# EAGLE design Schematic (EAGLE 6.6.0)
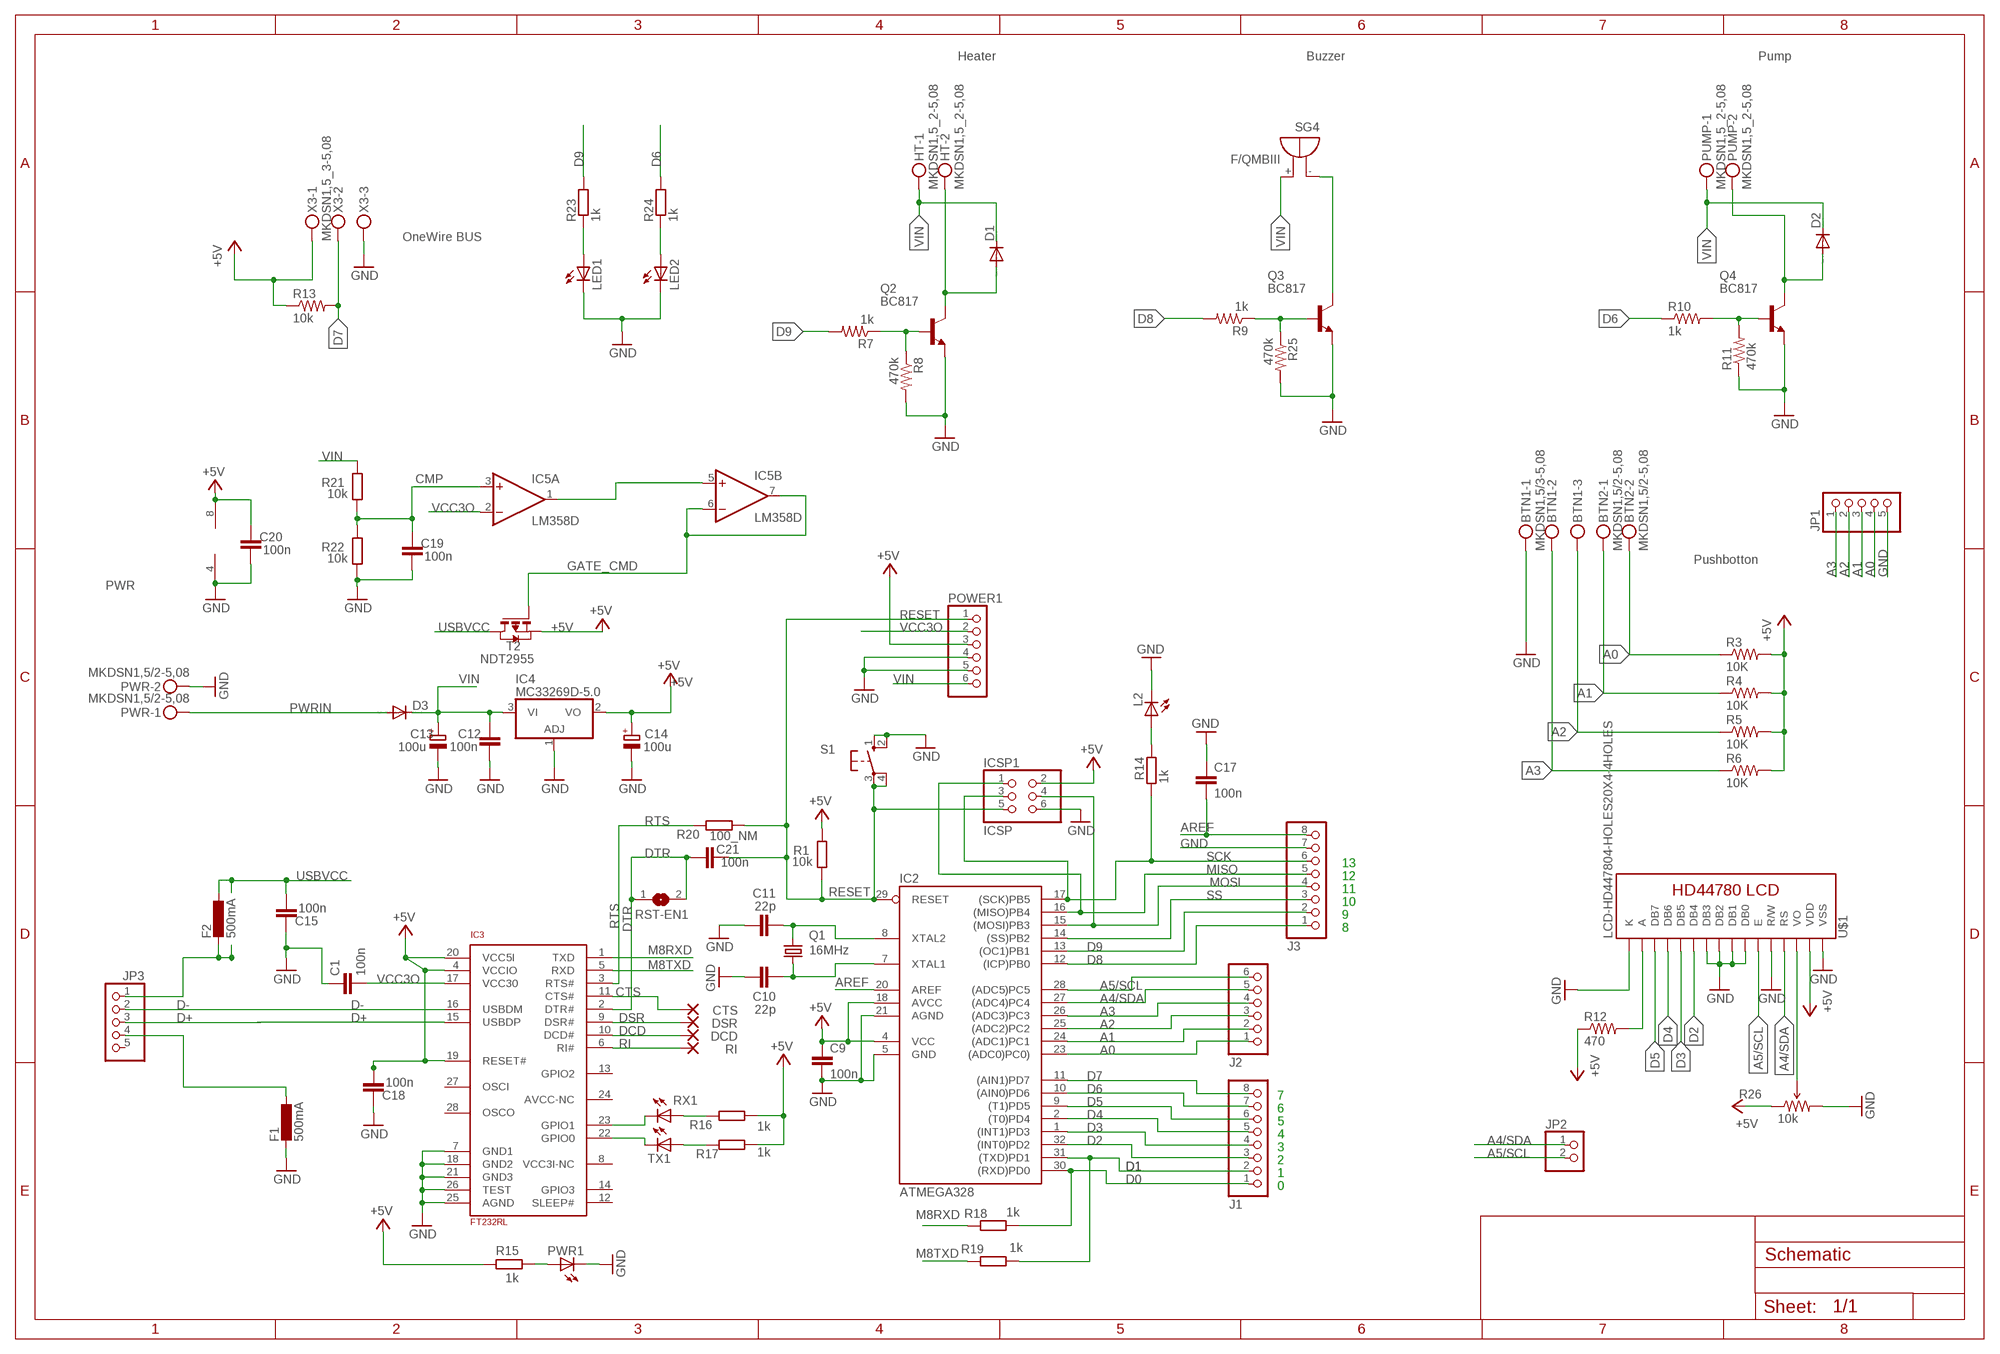
[diagram p0: schematic, sheet 1]

## Parts
BTN1  MKDSN1,5/3-5,08  [MKDSN1,5/3-5,08]
BTN2  MKDSN1,5/2-5,08  [MKDSN1,5/2-5,08]
C1  100n  C-EUC0603  [C0603]
C9  100n  C-EUC0603  [C0603]
C10  22p  C-EUC0603  [C0603]
C11  22p  C-EUC0603  [C0603]
C12  100n  C-EUC0603  [C0603]
C13  100u  CPOL-EUD  [PANASONIC_D]
C14  100u  CPOL-EUD  [PANASONIC_D]
C15  100n  C-EUC0603  [C0603]
C17  100n  C-EUC0603  [C0603]
C18  100n  C-EUC0603  [C0603]
C19  100n  C-EUC0603  [C0603]
C20  100n  C-EUC0603  [C0603]
C21  100n  C-EUC0603  [C0603]
CTS  SMD2  [SMD1,27-2,54]
D1  DIODE-SMB  [SMB]
D2  DIODE-SMB  [SMB]
D3  DIODE-SMB  [SMB]
DCD  SMD2  [SMD1,27-2,54]
DSR  SMD2  [SMD1,27-2,54]
F1  500mA  L-EUL1812  [L1812]
F2  500mA  L-EUL1812  [L1812]
HT  MKDSN1,5_2-5,08  [MKDSN1,5-2-5,08]
IC2  ATMEGA328  AT90S4433A  [TQFP32-08]
IC3  FT232RL  [SSOP28]
IC4  MC33269D-5.0  [DPACK]
IC5  LM358D  [SO08]
ICSP1  ICSP  PINHD-2X3  [2X03]
J1  PINHD-1X8  [1X08]
J2  PINHD-1X6  [1X06]
J3  PINHD-1X8  [1X08]
JP1  PINHD-1X5/90  [1X05/90]
JP2  PINHD-1X2/90  [1X02/90]
JP3  PINHD-1X5/90  [1X05/90]
L2  LEDSML0805  [SML0805]
LED1  LED5MM  [LED5MM]
LED2  LED5MM  [LED5MM]
POWER1  PINHD-1X6  [1X06]
PUMP  MKDSN1,5_2-5,08  [MKDSN1,5-2-5,08]
PWR  MKDSN1,5/2-5,08  [MKDSN1,5/2-5,08]
PWR1  LEDSML0805  [SML0805]
Q1  16MHz  CRYTALHC49S  [HC49/S]
Q2  BC817  BC817-NPN-SOT23-BEC  [SOT23-BEC]
Q3  BC817  BC817-NPN-SOT23-BEC  [SOT23-BEC]
Q4  BC817  BC817-NPN-SOT23-BEC  [SOT23-BEC]
R1  10k  R-EU_R0603  [R0603]
R3  10K  R-US_R0603  [R0603]
R4  10K  R-US_R0603  [R0603]
R5  10K  R-US_R0603  [R0603]
R6  10K  R-US_R0603  [R0603]
R7  1k  R-US_R0603  [R0603]
R8  470k  R-US_R0603  [R0603]
R9  1k  R-US_R0603  [R0603]
R10  1k  R-US_R0603  [R0603]
R11  470k  R-US_R0603  [R0603]
R12  470  R-US_R1206  [R1206]
R13  10k  R-US_R0603  [R0603]
R14  1k  R-EU_R0603  [R0603]
R15  1k  R-EU_R0603  [R0603]
R16  1k  R-EU_R0603  [R0603]
R17  1k  R-EU_R0603  [R0603]
R18  1k  R-EU_R0603  [R0603]
R19  1k  R-EU_R0603  [R0603]
R20  100_NM  R-EU_R0603  [R0603]
R21  10k  R-EU_R0603  [R0603]
R22  10k  R-EU_R0603  [R0603]
R23  1k  R-EU_R0603  [R0603]
R24  1k  R-EU_R0603  [R0603]
R25  470k  R-US_R0603  [R0603]
R26  10k  TRIMPOTTRIMPOT-5MM  [TRIMPOT-5MM]
RI  SMD2  [SMD1,27-2,54]
RST-EN1  SJ  [SJ]
RX1  LEDSML0805  [SML0805]
S1  10-XX  [B3F-10XX]
SG4  F/QMBIII  [F/QMBIII]
T2  NDT2955  PMOSSOT223  [SOT223]
TX1  LEDSML0805  [SML0805]
U$1  LCD-HD447804-HOLES20X4-4HOLES  [LCD-20X4-4HOLES]
X3  MKDSN1,5_3-5,08  [MKDSN1,5-3-5,08]

## Nets
+5V [+5V]: C9.1 C14.+ C18.1 C20.2 IC2.4(VCC) IC2.18(AVCC) IC3.4(VCCIO) IC3.19(RESET#) IC3.20(VCC5I) IC4.2(VO) IC5.8(P:V+) ICSP1.2 POWER1.3 R1.2 R3.2 R4.2 R5.2 R6.2 R12.1 R13.1 R15.1 R16.2 R17.2 R26.A(CCW) T2.3(S) U$1.P$2(VDD) X3.1
A0: BTN2.2 IC2.23((ADC0)PC0)) J2.1 JP1.4 R3.1
A1: BTN2.1 IC2.24((ADC1)PC1) J2.2 JP1.3 R4.1
A2: BTN1.3 IC2.25((ADC2)PC2) J2.3 JP1.2 R5.1
A3: BTN1.2 IC2.26((ADC3)PC3) J2.4 JP1.1 R6.1
A4/SDA: IC2.27((ADC4)PC4) J2.5 JP2.1 U$1.P$4(RS)
A5/SCL: IC2.28((ADC5)PC5) J2.6 JP2.2 U$1.P$6(E)
AREF: C17.2 IC2.20(AREF) J3.8
CMP: C19.2 IC5.3(A:+IN) R21.1 R22.2
CTS: CTS.1(P) IC3.11(CTS#)
D0: IC2.30((RXD)PD0) J1.1 R18.1
D1: IC2.31((TXD)PD1) J1.2 R19.1
D2: IC2.32((INT0)PD2) J1.3 U$1.P$11(DB4)
D3: IC2.1((INT1)PD3) J1.4 U$1.P$12(DB5)
D4: IC2.2((T0)PD4) J1.5 U$1.P$13(DB6)
D5: IC2.9((T1)PD5) J1.6 U$1.P$14(DB7)
D6: IC2.10((AIN0)PD6) J1.7 R10.1 R24.2
D7: IC2.11((AIN1)PD7) J1.8 R13.2 X3.2
D8: IC2.12((ICP)PB0) J3.1 R9.2
D9: IC2.13((OC1)PB1) J3.2 R7.2 R23.2
D+: IC3.15(USBDP) JP3.3
D-: IC3.16(USBDM) JP3.2
DCD: DCD.1(P) IC3.10(DCD#)
DSR: DSR.1(P) IC3.9(DSR#)
DTR: C21.1 IC3.2(DTR#) RST-EN1.1 RST-EN1.2
GATE_CMD: IC5.6(B:-IN) IC5.7(B:OUT) T2.1(G)
GND: BTN1.1 C1.1 C9.2 C10.1 C11.1 C12.1 C13.- C14.- C15.2 C17.1 C18.2 C19.1 C20.1 F1.2 IC2.5(GND) IC2.21(AGND) IC3.7(GND1) IC3.18(GND2) IC3.21(GND3) IC3.25(AGND) IC3.26(TEST) IC4.1(ADJ) IC5.4(P:V-) ICSP1.6 J3.7 JP1.5 L2.C LED1.K(C) LED2.K(C) POWER1.4 POWER1.5 PWR1.C PWR.2 Q2.E Q3.E Q4.E R8.2 R11.1 R22.1 R25.2 R26.C(CW) S1.1(S) S1.2(S1) U$1.P$1(VSS) U$1.P$5(R/W) U$1.P$7(DB0) U$1.P$8(DB1) U$1.P$9(DB2) U$1.P$10(DB3) U$1.P$16(K) X3.3
M8RXD: IC3.1(TXD) R18.2
M8TXD: IC3.5(RXD) R19.2
MISO: IC2.16((MISO)PB4) ICSP1.1 J3.5
MOSI: IC2.15((MOSI)PB3) ICSP1.4 J3.4
N$3 [GND]: F1.1 JP3.4
N$4: D1.A HT.2 Q2.C
N$5: Q2.B R7.1 R8.1
N$6: D2.A PUMP.2 Q4.C
N$7: Q3.C SG4.-(+)
N$8: Q3.B R9.1 R25.1
N$9: Q4.B R10.2 R11.2
N$10: R12.2 U$1.P$15(A)
N$12: R26.B(WIPER) U$1.P$3(VO)
N$13: LED1.A R23.1
N$14: LED2.A R24.1
N$54: C10.2 IC2.7(XTAL1) Q1.1
N$55: C11.2 IC2.8(XTAL2) Q1.2
N$70: PWR1.A R15.2
N$71: IC3.23(GPIO1) RX1.C
N$72: IC3.22(GPIO0) TX1.C
N$73: R16.1 RX1.A
N$74: R17.1 TX1.A
N$75 [USBVCC]: F2.2 JP3.1
N$76: L2.A R14.1
N$77: IC5.1(A:OUT) IC5.5(B:+IN)
PWRIN [PWRIN]: D3.A PWR.1
RESET: C21.2 IC2.29(RESET) ICSP1.5 POWER1.1 R1.1 R20.2 S1.3(P) S1.4(P1)
RI: IC3.6(RI#) RI.1(P)
RTS: IC3.3(RTS#) R20.1
SCK: IC2.17((SCK)PB5) ICSP1.3 J3.6 R14.2
SS: IC2.14((SS)PB2) J3.3
USBVCC [USBVCC]: C15.1 F2.1 T2.2(D) T2.4(D)
VCC3O: C1.2 IC3.17(VCC30) IC5.2(A:-IN) POWER1.2
VIN [PWRIN]: C12.2 C13.+ D1.C D2.C D3.C HT.1 IC4.3(VI) POWER1.6 PUMP.1 R21.2 SG4.+(-)
Unconnected: IC3.8(VCC3I-NC) IC3.12(SLEEP#) IC3.13(GPIO2) IC3.14(GPIO3) IC3.24(AVCC-NC) IC3.27(OSCI) IC3.28(OSCO) JP3.5

## Notes on the sheet
- Heater | Buzzer | Pump
- OneWire BUS
- Pushbotton
- PWR
- 13
- 12
- 11
- 10
- 9
- 8
- 7
- 6
- 5
- 4
- 3
- 2
- 1
- 0

## Library data of the parts
BTN1 = con-phoenix-508:MKDSN1,5/3-5,08: MKDSN 1,5/ 3-5,08 Printklemme Nennstrom: 13,5 A Nennspannung: 250 V Rastermaß: 5,08 mm Polzahl: 3 Anschlussart: Schraubanschluss Montage: Löten Anschlussrichtung Leiter/Platine: 0 ° Artikelnummer: 1729131 Source: http://eshop.phoenixcontact.com .. 1729131.pdf; OC_NEWARK: unknown
BTN2 PWR = con-phoenix-508:MKDSN1,5/2-5,08: MKDSN 1,5/ 2-5,08 Printklemme Nennstrom: 13,5 A Nennspannung: 250 V Rastermaß: 5,08 mm Polzahl: 2 Anschlussart: Schraubanschluss Montage: Löten Anschlussrichtung Leiter/Platine: 0 ° Artikelnummer: 1729128 Source: http://eshop.phoenixcontact.com .. 1729128.pdf; OC_NEWARK: unknown
C1 C9-C12 C15 C17-C21 = rcl:C-EU: CAPACITOR, European symbol
C13 C14 = rcl:CPOL-EU: POLARIZED CAPACITOR, European symbol
CTS DCD DSR RI = wirepad:SMD2: SMD PAD
D1-D3 = diode:DIODE-: DIODE
F1 F2 = rcl:L-EU: INDUCTOR, European symbol
HT PUMP = con-phoenix-508:MKDSN1,5_2-5,08: MKDSN 1,5/ 2-5,08 Printklemme Nennstrom: 13,5 A Nennspannung: 250 V Rastermaß: 5,08 mm Polzahl: 2 Anschlussart: Schraubanschluss Montage: Löten Anschlussrichtung Leiter/Platine: 0 ° Artikelnummer: 1729128 Source: http://eshop.phoenixcontact.com .. 1729128.pdf; OC_NEWARK: unknown
IC2 = atmel:AT90S4433: MICROCONTROLLER 4 Kbytes FLASH 128 bytes SRAM 256 bytes EEPROM UART 6-channel 10 bit ADC; OC_FARNELL: unknown; OC_NEWARK: unknown
IC3 = SmartPrj:FT232RL
IC4 = linear:MC33269?*: Adjustable Output Low Dropout Voltage Regulator 800 mA Source: http://www.onsemi.com/pub/Collateral/MC33269-D.PDF
IC5 = linear:LM358: OP AMP also LM158; LM258; LM2904 Source: http://cache.national.com/ds/LM/LM158.pdf
ICSP1 = pinhead:PINHD-2X3: PIN HEADER
J1 J3 = pinhead:PINHD-1X8: PIN HEADER
J2 POWER1 = pinhead:PINHD-1X6: PIN HEADER
JP1 JP3 = pinhead:PINHD-1X5: PIN HEADER
JP2 = pinhead:PINHD-1X2: PIN HEADER
L2 LED1 LED2 PWR1 RX1 TX1 = led:LED: LED OSRAM: - CHIPLED LG R971, LG N971, LY N971, LG Q971, LY Q971, LO R971, LY R971 LH N974, LH R974 LS Q976, LO Q976, LY Q976 LO Q996 - Hyper CHIPLED LW Q18S LB Q993, LB Q99A, LB R99A - SideLED LS A670, LO A670, LY A670, LG A670, LP A670 LB A673, LV A673, LT A673, LW A673 LH A674 LY A675 LS A676, LA A676, LO A676, LY A676, LW A676 LS A679, LY A679, LG A679 - Hyper Micro SIDELED® LS Y876, LA Y876, LO Y876, LY Y876 LT Y87S - SmartLED LW L88C, LW L88S LB L89C, LB L89S, LG L890 LS L89K, LO L89K, LY L89K LS L896, LA L896, LO L896, LY L896 - TOPLED LS T670, LO T670, LY T670, LG T670, LP T670 LSG T670, LSP T670, LSY T670, LOP T670, LYG T670 LG T671, LOG T671, LSG T671 LB T673, LV T673, LT T673, LW T673 LH T674 LS T676, LA T676, LO T676, LY T676, LB T676, LH T676, LSB T676, LW T676 LB T67C, LV T67C, LT T67C, LS T67K, LO T67K, LY T67K, LW E67C LS E67B, LA E67B, LO E67B, LY E67B, LB E67C, LV E67C, LT E67C LW T67C LS T679, LY T679, LG T679 LS T770, LO T770, LY T770, LG T770, LP T770 LB T773, LV T773, LT T773, LW T773 LH T774 LS E675, LA E675, LY E675, LS T675 LS T776, LA T776, LO T776, LY T776, LB T776 LHGB T686 LT T68C, LB T68C - Hyper Mini TOPLED® LB M676 - Mini TOPLED Santana® LG M470 LS M47K, LO M47K, LY M47K Source: http://www.osram.convergy.de LUXEON: - LUMILED® LXK2-PW12-R00, LXK2-PW12-S00, LXK2-PW14-U00, LXK2-PW14-V00 LXK2-PM12-R00, LXK2-PM12-S00, LXK2-PM14-U00 LXK2-PE12-Q00, LXK2-PE12-R00, LXK2-PE12-S00, LXK2-PE14-T00, LXK2-PE14-U00 LXK2-PB12-K00, LXK2-PB12-L00, LXK2-PB12-M00, LXK2-PB14-N00, LXK2-PB14-P00, LXK2-PB14-Q00 LXK2-PR12-L00, LXK2-PR12-M00, LXK2-PR14-Q00, LXK2-PR14-R00 LXK2-PD12-Q00, LXK2-PD12-R00, LXK2-PD12-S00 LXK2-PH12-R00, LXK2-PH12-S00 LXK2-PL12-P00, LXK2-PL12-Q00, LXK2-PL12-R00 Source: www.luxeon.com KINGBRIGHT: KA-3528ASYC Source: www.kingbright.com
Q1 = crystal:CRYTAL: CRYSTAL
Q2-Q4 = transistor:*-NPN-: NPN Transistror BF959 corrected 2008.03.06
R1 R14-R24 = rcl:R-EU_: RESISTOR, European symbol
R3-R13 R25 = resistor:R-US_: RESISTOR, American symbol; OC_NEWARK: unknown
R26 = SparkFun-Electromechanical:TRIMPOT: Various small potentiometers for "set-and-forget" applications
RST-EN1 = jumper:SJ: SMD solder JUMPER
S1 = switch-omron:10-XX: OMRON SWITCH; MPN: B3F-1000; OC_FARNELL: 176432; OC_NEWARK: 36M3542
SG4 = buzzer:F/QMBIII: BUZZER Source: Buerklin; OC_FARNELL: unknown; OC_NEWARK: unknown
T2 = zetex:PMOSSOT223: MOS FET; OC_FARNELL: unknown; OC_NEWARK: unknown
U$1 = HD44780LCD:LCD-HD44780
X3 = con-phoenix-508:MKDSN1,5_3-5,08: MKDSN 1,5/ 3-5,08 Printklemme Nennstrom: 13,5 A Nennspannung: 250 V Rastermaß: 5,08 mm Polzahl: 3 Anschlussart: Schraubanschluss Montage: Löten Anschlussrichtung Leiter/Platine: 0 ° Artikelnummer: 1729131 Source: http://eshop.phoenixcontact.com .. 1729131.pdf; OC_NEWARK: unknown

## Net classes
0 default: width 0.254 mm, clearance 0.254 mm
1 PWRIN: width 0.61 mm, drill 0.508 mm, clearance 0.205 mm to class 0, clearance 0.254 mm
2 GND: width 0.305 mm, drill 0.508 mm, clearance 0.205 mm to class 0, clearance 0.205 mm to class 1, clearance 0.254 mm
3 USBVCC: width 0.508 mm, drill 0.508 mm, clearance 0.205 mm to class 0, clearance 0.205 mm to class 1, clearance 0.205 mm to class 2, clearance 0.254 mm
4 +5V: width 0.406 mm, drill 0.508 mm, clearance 0.205 mm to class 0, clearance 0.205 mm to class 1, clearance 0.205 mm to class 2, clearance 0.205 mm to class 3, clearance 0.254 mm

## Board
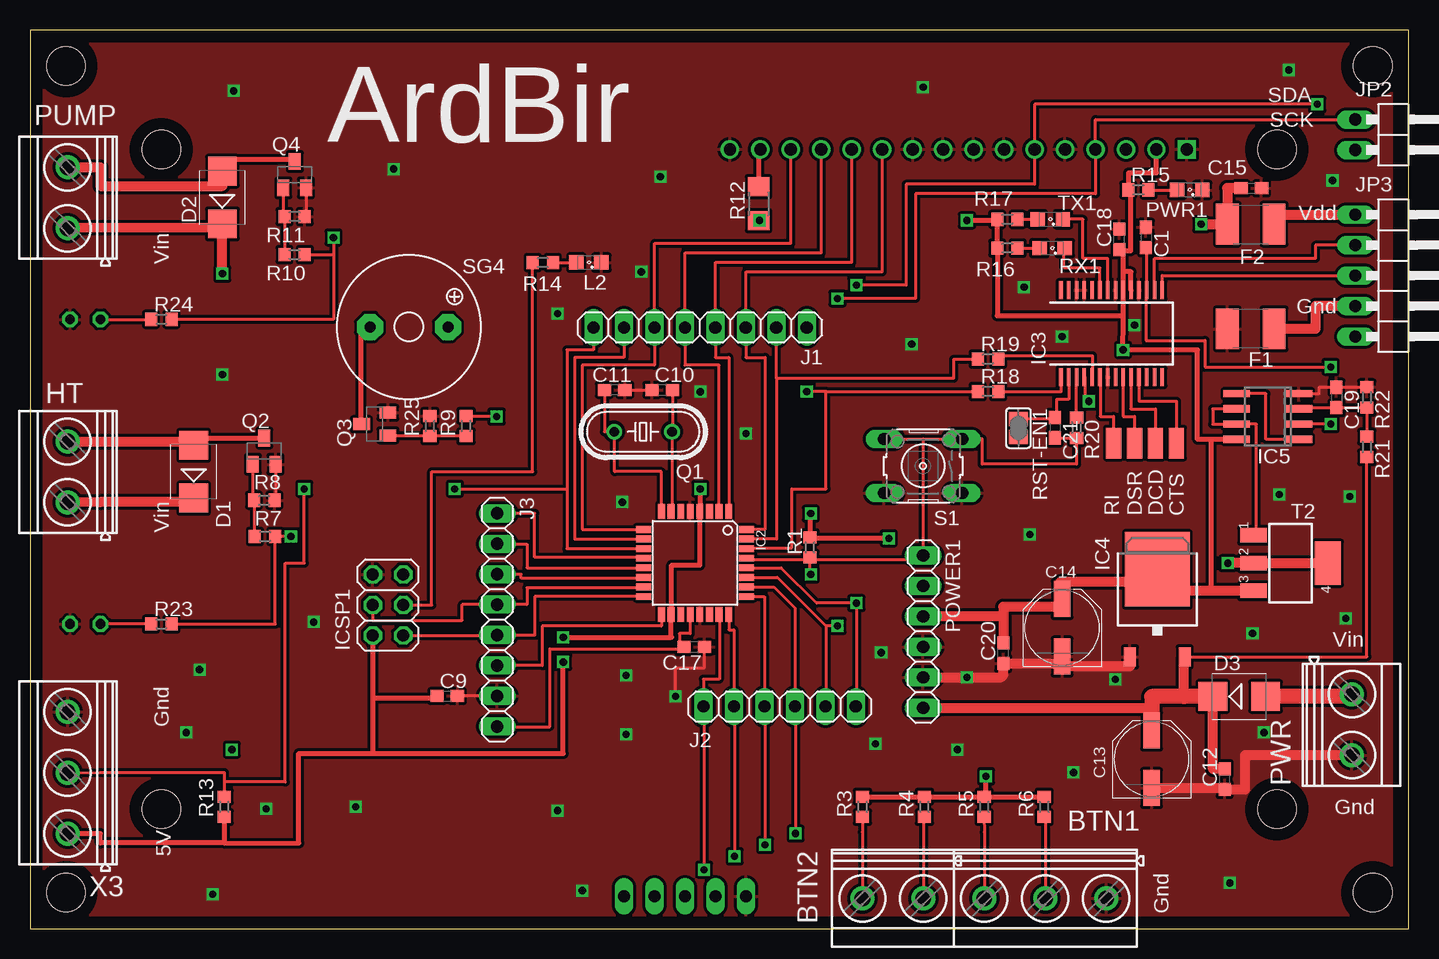
[diagram p1: board, top side]
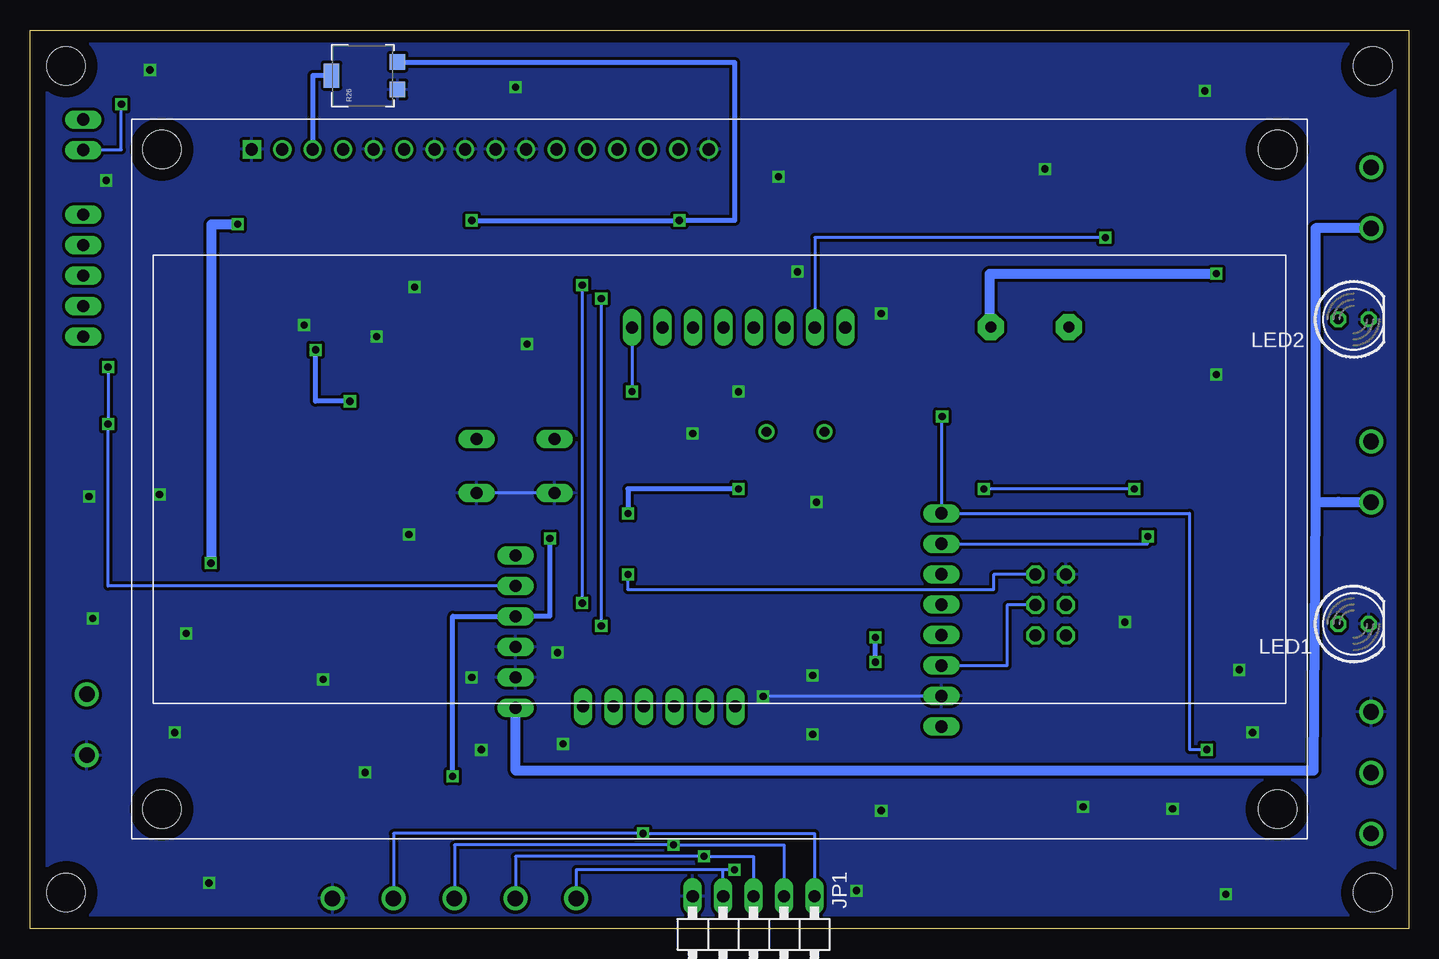
[diagram p2: board, bottom side, seen from below]

Size 114.93 x 74.93 mm. Coordinates in mm from the lower left corner, seen from the top.
Outline: 114.93,74.93 0,74.93 0,0 114.93,0 114.93,74.93
Copper layers (1*16): Top 0.035mm / dielectric 1.5mm / Bottom 0.035mm
Design rules "default *": minimum track width 10mil, minimum drill 20mil, track to track 8mil, track to pad 8mil, pad to pad 8mil, via to via 8mil, smd to smd 8mil, copper to edge 40mil, drill to drill 8mil, minimum pad ring 10mil, minimum via ring 8mil, stop-mask expansion 4mil, vias tented up to drill 0mil, thermal gap 10mil
Holes 3.2 mm at 3,3 3,71.93 111.93,3 111.93,71.93

### Footprints (pad centres in the part's own frame; a part is rotated, then mirrored left to right if it is on the bottom)
MKDSN1,5/3-5,08 = drill 1.3 pad 2: 1 -7.641,0.025; 2 -2.561,0.025; 3 2.519,0.025
MKDSN1,5/2-5,08 = drill 1.3 pad 2: 1 -2.561,0.025; 2 2.519,0.025
C0603 = smd 1.1 x 1: 1 -0.85,0; 2 0.85,0
PANASONIC_D = smd 3 x 1.4: + 2.4,0; - -2.4,0
SMD1,27-2,54 = smd 1.27 x 2.54: 1 0,0
SMB = smd 2.4 x 2.4: A 2.2,0; C -2.2,0
L1812 = smd 1.9 x 3.4: 1 -1.95,0; 2 1.95,0
MKDSN1,5-2-5,08 = drill 1.3 pad 2: 1 -2.561,0.025; 2 2.519,0.025
TQFP32-08 = smd 1.27 x 0.559: 1 -4.293,2.8; 2 -4.293,2; 3 -4.293,1.2; 4 -4.293,0.4; 5 -4.293,-0.4; 6 -4.293,-1.2; 7 -4.293,-2; 8 -4.293,-2.8; 17 4.293,-2.8; 18 4.293,-2; 19 4.293,-1.2; 20 4.293,-0.4; 21 4.293,0.4; 22 4.293,1.2; 23 4.293,2; 24 4.293,2.8 | smd 0.559 x 1.27: 9 -2.8,-4.293; 10 -2,-4.293; 11 -1.2,-4.293; 12 -0.4,-4.293; 13 0.4,-4.293; 14 1.2,-4.293; 15 2,-4.293; 16 2.8,-4.293; 25 2.8,4.293; 26 2,4.293; 27 1.2,4.293; 28 0.4,4.293; 29 -0.4,4.293; 30 -1.2,4.293; 31 -2,4.293; 32 -2.8,4.293
SSOP28 = smd 0.381 x 1.499: 1 -4.225,-3.625; 2 -3.575,-3.625; 3 -2.925,-3.625; 4 -2.275,-3.625; 5 -1.625,-3.625; 6 -0.975,-3.625; 7 -0.325,-3.625; 8 0.325,-3.625; 9 0.975,-3.625; 10 1.625,-3.625; 11 2.275,-3.625; 12 2.925,-3.625; 13 3.575,-3.625; 14 4.225,-3.625; 15 4.225,3.625; 16 3.575,3.625; 17 2.925,3.625; 18 2.275,3.625; 19 1.625,3.625; 20 0.975,3.625; 21 0.325,3.625; 22 -0.325,3.625; 23 -0.975,3.625; 24 -1.625,3.625; 25 -2.275,3.625; 26 -2.925,3.625; 27 -3.575,3.625; 28 -4.225,3.625
DPACK = smd 1 x 1.6: 1 -2.28,-4.8; 3 2.28,-4.8 | smd 5.4 x 6.2: 2 0,2.5
SO08 = smd 0.6 x 2.2: 1 -1.905,-2.6; 2 -0.635,-2.6; 3 0.635,-2.6; 4 1.905,-2.6; 5 1.905,2.6; 6 0.635,2.6; 7 -0.635,2.6; 8 -1.905,2.6
2X03 = drill 1.016 octagon: 1 -2.54,-1.27; 2 -2.54,1.27; 3 0,-1.27; 4 0,1.27; 5 2.54,-1.27; 6 2.54,1.27
1X08 = drill 1.016 long: 1 -8.89,0; 2 -6.35,0; 3 -3.81,0; 4 -1.27,0; 5 1.27,0; 6 3.81,0; 7 6.35,0; 8 8.89,0
1X06 = drill 1.016 long: 1 -6.35,0; 2 -3.81,0; 3 -1.27,0; 4 1.27,0; 5 3.81,0; 6 6.35,0
1X05/90 = drill 1.016 long: 1 -5.08,-3.81; 2 -2.54,-3.81; 3 0,-3.81; 4 2.54,-3.81; 5 5.08,-3.81
1X02/90 = drill 1.016 long: 1 -1.27,-3.81; 2 1.27,-3.81
SML0805 = smd 1.2 x 1.2: A 1.05,0; C -1.05,0
LED5MM = drill 0.813 octagon: A -1.27,0; K 1.27,0
HC49/S = drill 0.813: 1 -2.413,0; 2 2.413,0
SOT23-BEC = smd 1 x 1.4: B -0.95,-1.1; C 0,1.1; E 0.95,-1.1
R0603 = smd 1 x 1.1: 1 -0.85,0; 2 0.85,0
R1206 = smd 1.6 x 1.803: 1 -1.422,0; 2 1.422,0
TRIMPOT-5MM = smd 1.3 x 1.3: A 1.15,-2.54; C -1.15,-2.54 | smd 2 x 1.3: B 0,2.96
SJ = smd 1.168 x 1.6: 1 -0.762,0; 2 0.762,0
B3F-10XX = drill 1.016 long: 1 -3.251,2.261; 2 3.251,2.261; 3 -3.251,-2.261; 4 3.251,-2.261
F/QMBIII = drill 0.914 pad 2.159 octagon: + 3.251,0; - -3.251,0
SOT223 = smd 1.219 x 2.235: 1 -2.311,-3.099; 2 0,-3.099; 3 2.311,-3.099 | smd 3.6 x 2.2: 4 0,3.099
LCD-20X4-4HOLES = drill 1.016 square: P$1 10,57.5 | drill 1.016: P$2 12.54,57.5; P$3 15.08,57.5; P$4 17.62,57.5; P$5 20.16,57.5; P$6 22.7,57.5; P$7 25.24,57.5; P$8 27.78,57.5; P$9 30.32,57.5; P$10 32.86,57.5; P$11 35.4,57.5; P$12 37.94,57.5; P$13 40.48,57.5; P$14 43.02,57.5; P$15 45.56,57.5; P$16 48.1,57.5 | hole 3.2: 2.5,2.5; 2.5,57.5; 95.5,57.5; 95.5,2.5
MKDSN1,5-3-5,08 = drill 1.3 pad 2: 1 -7.641,0.025; 2 -2.561,0.025; 3 2.519,0.025

### Placement (x,y rotation side)
BTN1  82.07,2.54 180 top
BTN2  71.91,2.54 180 top
C1  93.03,57.63 270 top
C9  34.78,19.39 0 top
C10  52.7,44.93 0 top
C11  48.74,44.93 180 top
C12  99.6,12.47 90 top
C13  93.5,14.13 90 top
C14  86.04,25.08 90 top
C15  101.81,61.73 0 top
C17  55.37,23.47 180 top
C18  90.81,57.47 90 top
C19  108.9,44.29 270 top
C20  81.13,22.96 90 top
C21  85.43,41.77 270 top
CTS  95.57,40.48 0 top
D1  13.65,38.1 90 top
D2  16.03,60.96 90 top
D3  100.81,19.37 0 top
DCD  93.82,40.48 0 top
DSR  92.08,40.48 0 top
F1  101.76,50.01 180 top
F2  101.76,58.74 0 top
HT  3.16,38.1 90 top
IC2  55.44,30.49 270 top
IC3  90.16,49.62 0 top
IC4  93.98,27.46 0 top
IC5  103.19,42.7 90 top
ICSP1  29.84,26.99 90 top
J1  55.86,50.13 180 top
J2  62.49,18.52 0 top
J3  38.95,25.74 270 top
JP1  54.61,-1.11 180 bottom
JP2  114.3,66.2 270 top
JP3  114.3,54.45 270 top
L2  46.59,55.54 180 top
LED1  4.6,25.4 0 bottom
LED2  4.6,50.8 0 bottom
POWER1  74.45,24.77 270 top
PUMP  3.16,60.96 90 top
PWR  110.17,16.99 270 top
PWR1  96.68,61.59 180 top
Q1  51.12,41.43 180 top
Q2  19.53,39.81 0 top
Q3  28.73,42.07 90 top
Q4  22.07,62.87 0 top
R1  65.02,31.79 90 top
R3  69.4,10.16 90 top
R4  74.56,10.16 90 top
R5  79.54,10.16 90 top
R6  84.54,10.16 90 top
R7  19.59,32.7 0 top
R8  19.53,35.72 0 top
R9  36.35,41.91 90 top
R10  22.07,56.2 180 top
R11  22.07,59.37 180 top
R12  60.74,60.45 90 top
R13  16.19,10.16 90 top
R14  42.75,55.54 180 top
R15  92.39,61.59 0 top
R16  81.48,56.75 180 top
R17  81.48,59.14 180 top
R18  79.86,44.79 0 top
R19  79.86,47.49 0 top
R20  87.24,41.77 270 top
R21  111.44,40.16 270 top
R22  111.44,44.29 270 top
R23  10.95,25.4 0 top
R24  10.95,50.8 0 top
R25  33.34,41.91 90 top
R26  86.84,71.12 90 bottom
RI  90.33,40.48 0 top
RST-EN1  82.4,41.74 270 top
RX1  85.21,56.75 180 top
S1  74.45,38.58 180 top
SG4  31.59,50.16 0 top
T2  105.09,30.48 270 top
TX1  85.05,59.14 180 top
U$1  106.44,7.47 0 bottom
X3  3.16,15.56 90 top

### Tracks (layer width: path | path; a pad name or v marks a point on that pad's centre or on a via)
+5V  (via drill 0.6)
  Top 0.254: IC3.4 87.95,45.99 87.95,43.97 v88.27,43.97
  Top 0.406: R3.2 R4.2 R5.2 79.69,11.01 | 16.19,7.14 22.41,7.14 22.41,14.61 28.57,14.61 | 91.14,54.77 IC3.20 91.14,51.12 | 91.14,54.77 91.14,56.52 | 91.14,56.52 91.76,56.52 91.76,61.59 91.6,61.59 | 28.57,14.61 44.45,14.61 v44.45,22.23 | v44.45,24.29 53.44,24.29 | ICSP1.2 28.57,19.21 | 28.57,19.21 28.57,14.61 | 79.69,11.01 v79.69,12.7 | IC5.8 98.42,40.8 | 98.42,40.8 98.42,28.17 | 91.14,54.77 91.79,54.77 IC3.19 | 91.14,51.12 91.14,50.64 v91.12,48.26 97.31,48.26 97.31,40.8 98.42,40.8 | v71.6,32.54 65.02,32.54 R1.2 65.02,34.61 v65.09,34.61 | 80.63,59.4 R17.2 | R17.2 R16.2 80.63,51.12 91.14,51.12 | 91.5,61.59 R15.1 91.6,61.59 | R17.2 80.63,59.37 | R13.1 16.19,7.93 16.19,7.14 | 16.19,7.14 5.87,7.14 5.87,7.92 X3.1 | C18.1 90.81,56.52 91.14,56.52 | 81.13,26.83 81.13,26.19 81.12,26.19 | 79.69,11.01 R6.2 | C9.1 33.93,19.21 28.57,19.21 | R17.2 80.63,59.05 v78.11,59.05 | v60.8,59.05 60.64,59.03 R12.1 | 53.5,24.29 53.44,24.29 | 53.44,24.29 IC2.18 53.5,26.2 53.5,30.32 55.84,30.32 IC2.4 55.88,34.78 v55.88,36.67 | 91.6,61.59 91.6,63.02 93.9,63.02 U$1.P$2
  Top 0.813: T2.3 98.42,28.17 94.77,28.17 94.77,28.89 93.98,28.89 | 93.98,28.89 85.88,28.89 85.88,26.83 | 85.88,26.83 86.04,26.83 C14.+ | 85.88,26.83 81.13,26.83 C20.2 | IC4.2 93.98,28.89 | 81.12,26.19 81.12,26.04 POWER1.3
  Bottom 0.406: v44.45,22.23 v44.45,24.29 | v79.69,12.7 79.69,26.04 POWER1.3 71.6,26.04 v71.6,32.54 | v88.27,43.97 91.12,43.97 v91.12,48.26 | v78.11,59.05 v60.8,59.05 56.2,59.05 56.2,72.23 84.3,72.23 R26.A | v55.88,36.67 65.09,36.67 v65.09,34.61
A0  (via drill 0.6)
  Top 0.254: R3.1 69.39,8.04 BTN2.2 | v56.2,18.52 v56.2,4.92 | IC2.23 57.47,26.2 57.47,20.8 56.14,20.8 J2.1
  Bottom 0.254: J2.1 v56.2,18.52 | v56.2,4.92 57.15,4.92 | 57.15,4.92 69.39,4.92 BTN2.2 | JP1.4 57.15,4.92
A1  (via drill 0.6)
  Top 0.254: v58.74,18.52 v58.74,6.03 | IC2.24 58.26,26.2 58.26,24.92 58.68,24.92 J2.2 | R4.1 74.47,9.31 BTN2.1
  Bottom 0.254: J2.2 v58.74,18.52 | BTN2.1 74.47,6.03 v58.74,6.03 54.61,6.03 JP1.3
A2  (via drill 0.6)
  Top 0.254: R5.1 79.56,8.04 BTN1.3 | v61.28,18.52 v61.28,6.99 | IC2.25 61.22,27.69 J2.3
  Bottom 0.254: J2.3 v61.28,18.52 | BTN1.3 79.56,6.99 v61.28,6.99 52.07,6.99 JP1.2
A3  (via drill 0.6)
  Top 0.254: v63.82,18.52 v63.82,7.94 | IC2.26 62.01,28.49 63.76,26.74 J2.4 | R6.1 84.64,9.31 BTN1.2
  Bottom 0.254: J2.4 v63.82,18.52 | BTN1.2 84.64,7.94 v63.82,7.94 49.53,7.94 JP1.1
A4/SDA  (via drill 0.6)
  Top 0.254: IC2.27 62.31,29.29 66.36,25.24 | 66.36,25.24 66.36,18.58 J2.5 | v67.31,52.55 73.82,52.55 73.82,61.28 88.82,61.28 U$1.P$4 88.82,67.47 JP2.1 | v67.31,25.24 66.36,25.24
  Bottom 0.254: v67.31,52.55 v67.31,25.24
A5/SCL  (via drill 0.6)
  Top 0.254: IC2.28 62.62,30.09 65.56,27.15 v68.9,27.15 68.9,18.58 J2.6 | v68.9,53.66 73.03,53.66 73.03,62.07 83.74,62.07 U$1.P$6 83.74,68.74 v107.31,68.74
  Bottom 0.254: v68.9,53.66 v68.9,27.15 | JP2.2 107.31,64.93 v107.31,68.74
AREF
  Top 0.254: IC2.20 55.04,24.61 54.13,24.61 54.13,23.47 C17.2 54.52,23.34 43.34,23.34 43.34,16.83 38.95,16.83 J3.8
CMP
  Top 0.254: IC5.3 105.79,43.44 C19.2 R22.2 R21.1
CTS
  Top 0.254: IC3.11 92.44,43.97 95.57,43.97 CTS.1
D0  (via drill 0.6)
  Top 0.254: IC2.30 59.73,31.75 63.5,31.75 63.5,36.67 66.36,36.67 66.36,44.79 | 66.36,44.79 R18.1 | 66.36,44.79 v64.75,44.79
  Bottom 0.254: J1.1 v64.75,44.79
D1
  Top 0.254: R19.1 79.02,47.47 76.99,47.47 76.99,45.88 62.23,45.88 | 62.23,45.88 62.23,32.49 IC2.31 | 62.23,45.88 62.23,50.13 J1.2
D2
  Top 0.254: IC2.32 61.28,33.29 61.28,47.62 59.67,47.62 J1.3 59.69,50.13 59.69,54.77 71.04,54.77 U$1.P$11
D3
  Top 0.254: IC2.1 58.26,34.78 58.26,47.62 57.13,47.62 J1.4 57.15,50.13 57.15,55.56 68.5,55.56 U$1.P$12
D4
  Top 0.254: IC2.2 57.44,46.99 54.59,46.99 J1.5 54.61,50.13 54.61,56.36 65.96,56.36 U$1.P$13
D5
  Top 0.254: IC2.9 46.04,33.29 46.04,46.99 52.05,46.99 J1.6 52.07,50.13 52.07,57.15 63.42,57.15 U$1.P$14
D6  (via drill 0.6)
  Top 0.254: J1.7 49.51,47.62 45.4,47.62 45.4,32.49 IC2.10 | v25.3,57.63 25.3,56.2 | 25.3,56.2 25.3,50.8 R24.2 | R10.1 25.3,56.2
  Bottom 0.254: v25.3,57.63 49.51,57.63 J1.7
D7  (via drill 0.6)
  Top 0.254: J1.8 46.97,48.26 44.77,48.26 44.77,36.67 | 44.77,36.67 44.77,31.69 IC2.11 | v22.86,36.67 22.86,30.48 21.27,30.48 21.27,12.22 16.19,12.22 | v35.4,36.67 44.77,36.67 | X3.2 5.85,13.02 16.19,13.02 16.19,12.22 | 16.19,12.22 R13.2
  Bottom 0.254: v22.86,36.67 v35.4,36.67
D8  (via drill 0.6)
  Top 0.254: IC2.12 51.15,30.96 42.07,30.96 42.07,34.63 J3.1 | v38.89,42.7 36.51,42.7 R9.2
  Bottom 0.254: v16.83,14.92 18.26,14.92 18.26,34.63 J3.1 38.89,34.63 v38.89,42.7
D9  (via drill 0.6)
  Top 0.254: J3.2 38.95,32.07 41.43,32.07 41.43,30.09 IC2.13 | R23.2 20.44,25.4 R7.2 v21.75,32.7
  Bottom 0.254: J3.2 21.75,32.09 v21.75,32.7
D+
  Top 0.254: IC3.15 94.39,54.45 JP3.3
D-
  Top 0.254: IC3.16 93.74,55.88 107.16,55.88 107.16,56.99 JP3.2
DCD
  Top 0.254: IC3.10 91.76,45.96 91.76,43.34 93.82,43.34 DCD.1
DSR
  Top 0.254: IC3.9 91.12,45.98 91.12,42.7 92.08,42.7 DSR.1
DTR
  Top 0.254: IC3.2 86.59,44.13 85.57,44.13 85.57,42.68 C21.1 85.43,42.5 RST-EN1.1 RST-EN1.2
GATE_CMD
  Top 0.254: IC5.6 98.58,43.34 98.58,42.07 IC5.7 102.23,42.07 102.23,32.79 T2.1
GND  (via drill 0.6)
  Top 0.254: Q4.E 23.02,59.37 R11.1 | Q2.E 20.48,35.72 R8.2 | IC5.4 107.47,44.61 107.47,45.14 C19.1 R22.1 | C11.1 C10.1 | J3.7 C9.2 | 55.88,23.47 C17.1 56.22,21.75 53.82,21.75 v53.82,19.37
  Top 0.813: C13.- 99.6,11.73 C12.1 99.6,11.59 101.28,11.59 101.28,14.47 PWR.2 | IC4.1 91.7,21.91 86.04,21.91 86.04,22.11 C20.1 81.13,21.12 80.96,20.95 v78.11,20.95 POWER1.5
  Bottom 0.254: J3.7 38.95,19.37 v53.82,19.37 | S1.2 S1.1
  other vias: 16.99,69.85 30.32,63.34 52.55,62.71 50.96,54.77 14.13,21.59 13.02,16.35 15.24,2.86 27.15,10.16 43.97,9.84 46.04,3.17 49.69,16.19 49.69,21.11 23.65,25.56 43.97,51.28 74.45,70.17 104.93,71.6 108.58,62.39 104.14,36.2 83.34,32.86 73.5,48.74 86.04,49.37 59.69,41.27 55.88,44.77 49.37,35.56 70.48,15.4 70.96,23.02 77.31,14.92 87,13.02 90.49,20.8 100.01,3.81 102.87,16.35 101.92,24.61 109.7,25.88 110.01,36.04 16.03,46.2 19.68,10 82.87,53.5 92.08,50.32
  pour Bottom: 1.11,74.45 1.11,0.16 113.51,0.32 113.51,74.61
  pour Top: 1.11,74.45 1.11,0.16 113.51,0.32 113.51,74.61
M8RXD
  Top 0.254: R18.2 80.62,44.77 85.94,44.77 IC3.1
M8TXD
  Top 0.254: R19.2 80.72,47.78 88.58,47.78 88.58,45.99 IC3.5
MISO
  Top 0.254: IC2.16 42.07,27.69 42.07,24.47 J3.5 38.95,24.45 ICSP1.1
MOSI
  Top 0.254: IC2.15 51.15,28.42 41.43,28.42 41.43,27.01 J3.4 36.04,27.01 36.04,25.72 28.57,25.72 ICSP1.4
N$3
  Top 0.406: F1.1 103.71,50.8
  Top 0.813: JP3.4 107.16,51.91 107.16,50.01 F1.1
N$4
  Top 0.406: HT.2 | 13.65,40.62 13.65,40.91 Q2.C
  Top 0.813: HT.2 13.65,40.62 D1.A
N$5
  Top 0.254: Q2.B 18.58,35.72 R8.1 18.74,35.72 R7.1
N$6
  Top 0.406: Q4.C 22.07,64.14 15.72,64.14 15.72,63.16 D2.A
  Top 0.813: PUMP.2 5.87,63.48 5.87,61.91 16.03,61.91 D2.A
N$7
  Top 0.406: Q3.C 27.62,50.16 SG4.-
N$8
  Top 0.254: R9.1 R25.1 29.83,41.06 Q3.B
N$9
  Top 0.254: Q4.B 21.12,59.37 | R11.2 R10.2
  Top 0.406: 21.12,59.37 R11.2
N$10
  Top 0.406: U$1.P$15 60.74,64.97 R12.2
N$12
  Bottom 0.406: R26.B 91.36,71.12 U$1.P$3
N$13
  Top 0.254: R23.1 LED1.A
N$14
  Top 0.254: LED2.A R24.1
N$54
  Top 0.254: IC2.7 53.53,34.78 Q1.1 53.55,41.43 C10.2
N$55
  Top 0.254: IC2.8 52.64,38.1 48.74,38.1 48.74,41.43 Q1.2 47.89,41.43 C11.2
N$70
  Top 0.254: R15.2 PWR1.A
N$71
  Top 0.254: IC3.23 89.19,55.09 86.2,55.09 86.2,57.06 RX1.C
N$72
  Top 0.254: IC3.22 89.84,55.88 87.79,55.88 87.79,59.14 TX1.C
N$73
  Top 0.254: R16.1 RX1.A
N$74
  Top 0.254: R17.1 TX1.A
N$75
  Top 0.813: 103.71,58.42 F2.2 103.71,59.53 JP3.1
N$76
  Top 0.254: R14.1 L2.A
N$77
  Top 0.254: IC5.1 103.03,40.8 103.03,44.61 IC5.5
PWRIN
  Top 1.27: PWR.1 110.02,19.37 D3.A
RESET  (via drill 0.6)
  Top 0.254: IC2.29 59.83,30.8 65.02,30.8 | 65.02,30.8 74.45,30.8 POWER1.1 74.45,40.84 | 65.02,30.8 R1.1 65.02,29.53 v65.09,29.53 | 74.45,40.84 S1.3 79.38,40.84 79.38,38.73 87.24,38.73 R20.2 C21.2 | S1.4 74.45,40.84
  Bottom 0.254: v65.09,29.53 65.09,28.26 34.61,28.26 34.61,29.53 ICSP1.5
RI
  Top 0.254: IC3.6 89.22,45.96 89.22,42.7 90.33,42.7 RI.1
RTS
  Top 0.254: R20.1 IC3.3
SCK
  Top 0.254: IC2.17 52.64,25.24 42.7,25.24 42.7,21.93 J3.6 | ICSP1.3 33.5,26.99 33.5,38.1 41.9,38.1 R14.2
  Bottom 0.254: ICSP1.3 33.5,26.99 33.5,21.93 J3.6
SS
  Top 0.254: IC2.14 51.15,29.21 40.96,29.21 40.96,29.55 J3.3
USBVCC  (via drill 0.6)
  Top 0.813: T2.4 T2.2 v99.85,30.48 | C15.1 99.81,61.75 F2.1 v97.63,58.74
  Bottom 0.813: v97.63,58.74 F2.1 99.81,30.48 v99.85,30.48
VCC3O  (via drill 0.6)
  Top 0.254: C1.2 93.09,56.62 IC3.17 93.03,53.24 93.03,49.05 97.95,49.05 97.95,46.83 v108.43,46.83 | v108.43,42.07 IC5.2
  Bottom 0.254: POWER1.2 108.43,28.57 v108.43,42.07 v108.43,46.83
VIN  (via drill 0.6)
  Top 0.254: IC4.3 111.44,22.66 R21.2
  Top 0.813: IC4.3 96.2,22.66 96.2,19.37 | C12.2 98.61,13.32 D3.C | POWER1.6 93.5,18.41 93.5,17.62 | PUMP.1 15.85,58.44 D2.C v16.03,54.61 | D1.C 13.65,35.56 5.85,35.56 HT.1
  Top 1.27: D3.C 96.2,19.37 93.5,19.37 93.5,17.62 C13.+
  Bottom 0.813: PUMP.1 7.78,58.4 7.78,35.58 5.85,35.58 HT.1 7.78,35.54 7.94,13.18 74.45,13.18 POWER1.6 | v16.03,54.61 34.92,54.61 34.92,50.16 SG4.+

### Text on the board
tNames: SDA | SCK | ArdBir | Vdd | Vin | Gnd | Vin | Vin | Gnd | Gnd | 5V | Gnd